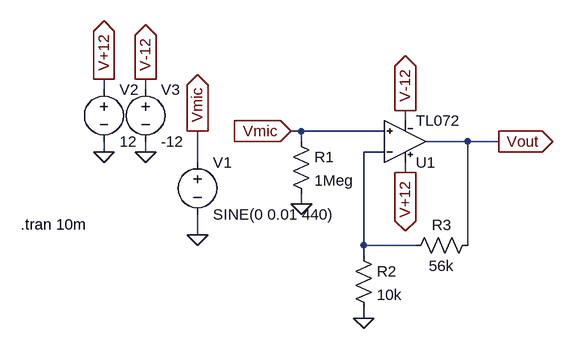
[diagram p0: schematic mikrophonie.asc]
mikrophonie.asc, the LTspice schematic file:
Version 4
SHEET 1 880 680
WIRE 0 128 0 112
WIRE 64 128 64 112
WIRE 464 176 464 160
WIRE 304 192 288 192
WIRE 432 192 304 192
WIRE 304 208 304 192
WIRE 560 208 496 208
WIRE 608 208 560 208
WIRE 0 224 0 208
WIRE 64 224 64 208
WIRE 432 224 400 224
WIRE 144 240 144 192
WIRE 464 256 464 240
WIRE 304 304 304 288
WIRE 144 352 144 320
WIRE 400 368 400 224
WIRE 480 368 400 368
WIRE 560 368 560 208
WIRE 400 384 400 368
WIRE 400 480 400 464
FLAG 144 352 0
FLAG 304 304 0
FLAG 0 224 0
FLAG 64 224 0
FLAG 0 112 V+12
IOPIN 0 112 Out
FLAG 64 112 V-12
IOPIN 64 112 Out
FLAG 464 160 V-12
IOPIN 464 160 Out
FLAG 464 256 V+12
IOPIN 464 256 Out
FLAG 144 192 Vmic
IOPIN 144 192 Out
FLAG 608 208 Vout
IOPIN 608 208 Out
FLAG 288 192 Vmic
IOPIN 288 192 In
FLAG 400 480 0
SYMBOL voltage 144 224 R0
SYMATTR InstName V1
SYMATTR Value SINE(0 0.01 440)
SYMATTR Value2 AC 0.01
SYMBOL Res 288 192 R0
SYMATTR InstName R1
SYMATTR Value 1Meg
SYMBOL voltage 0 112 R0
SYMATTR InstName V2
SYMATTR Value 12
SYMBOL voltage 64 112 R0
SYMATTR InstName V3
SYMATTR Value -12
SYMBOL Res 384 368 R0
SYMATTR InstName R2
SYMATTR Value 10k
SYMBOL Res 576 352 R90
WINDOW 0 0 56 VBottom 2
WINDOW 3 32 56 VTop 2
SYMATTR InstName R3
SYMATTR Value 56k
SYMBOL TL072 464 272 M180
SYMATTR InstName U1
TEXT -128 336 Left 2 !.tran 10m

The netlist it stands for:
* mikrophonie.asc
V1 Vmic 0 SINE(0 0.01 440) AC 0.01
R1 Vmic 0 1Meg
V2 V+12 0 12
V3 V-12 0 -12
R2 N001 0 10k
R3 Vout N001 56k
XU1 Vmic N001 V+12 V-12 Vout TL072  ; pins In+ In- V+ V- OUT
.tran 10m
.lib TL072.sub
.backanno
.end